# EAGLE design SmartSwitchBoard2x1 (EAGLE 6.2)
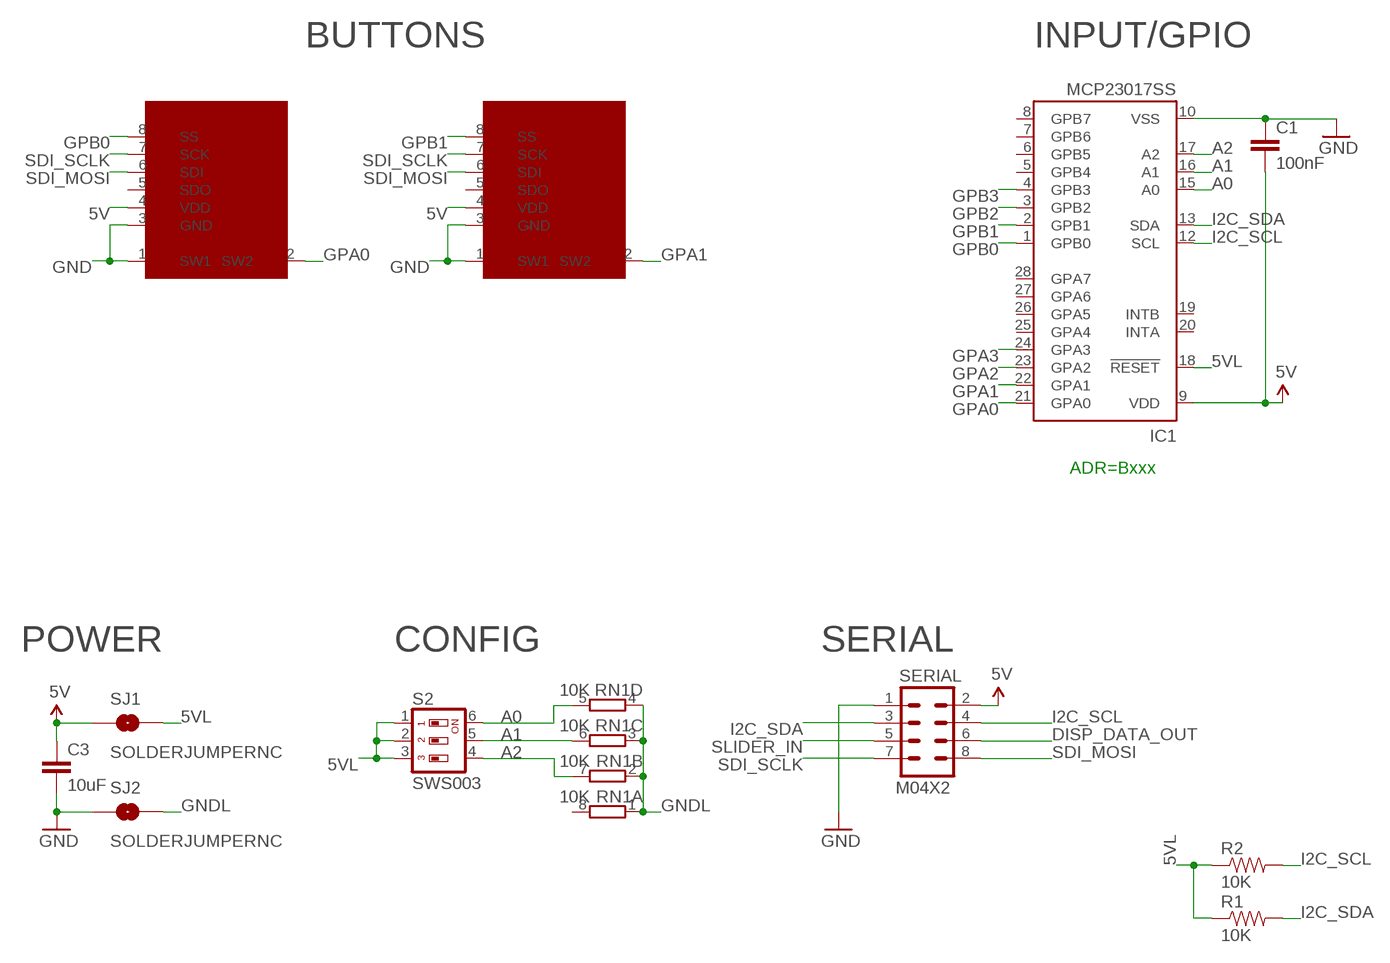
[diagram p0: schematic, sheet 1]

## Parts
C1  100nF  CAP0603-CAP  [0603-CAP]
C3  10uF  CAP0805  [0805]
IC1  MCP23017SS  [SSOP28]
R1  10K  RESISTOR0603-RES  [0603-RES]
R2  10K  RESISTOR0603-RES  [0603-RES]
RN1  10K  4R-NCAY16  [CAY16_HAND]
S2  SWS003  [SMS-003]
SERIAL  M04X2  [2X4]
SJ1  SOLDERJUMPERNC  [SJ_2S]
SJ2  SOLDERJUMPERNC  [SJ_2S]
U$2  SMART_SWITCHSMART_SWITCH_8PIN  [SMART_SWITCH]
U$3  SMART_SWITCHSMART_SWITCH_8PIN  [SMART_SWITCH]

## Nets
5V [Power]: C1.2 C3.1 IC1.9(VDD) SERIAL.2 SJ1.1 U$2.4(VDD) U$3.4(VDD)
5VL: IC1.18(!RESET) R1.1 R2.1 S2.1 S2.2 S2.3 SJ1.2
A0: IC1.15(A0) RN1.5 S2.6
A1: IC1.16(A1) RN1.6 S2.5
A2: IC1.17(A2) RN1.7 S2.4
DISP_DATA_OUT: SERIAL.6
GND [Power]: C1.1 C3.2 IC1.10(VSS) SERIAL.1 SJ2.1 U$2.1(SW1) U$2.3(GND) U$3.1(SW1) U$3.3(GND)
GNDL: RN1.1 RN1.2 RN1.3 RN1.4 SJ2.2
GPA0: IC1.21(GPA0) U$2.2(SW2)
GPA1: IC1.22(GPA1) U$3.2(SW2)
GPA2: IC1.23(GPA2)
GPA3: IC1.24(GPA3)
GPB0: IC1.1(GPB0) U$2.8(SS)
GPB1: IC1.2(GPB1) U$3.8(SS)
GPB2: IC1.3(GPB2)
GPB3: IC1.4(GPB3)
I2C_SCL: IC1.12(SCL) R2.2 SERIAL.4
I2C_SDA: IC1.13(SDA) R1.2 SERIAL.3
SDI_MOSI: SERIAL.8 U$2.6(SDI) U$3.6(SDI)
SDI_SCLK: SERIAL.7 U$2.7(SCK) U$3.7(SCK)
SLIDER_IN: SERIAL.5
Unconnected: IC1.5(GPB4) IC1.6(GPB5) IC1.7(GPB6) IC1.8(GPB7) IC1.19(INTB) IC1.20(INTA) IC1.25(GPA4) IC1.26(GPA5) IC1.27(GPA6) IC1.28(GPA7) RN1.8 U$2.5(SDO) U$3.5(SDO)

## Notes on the sheet
- BUTTONS | INPUT/GPIO
- ADR=Bxxx
- POWER | CONFIG | SERIAL

## Library data of the parts
C1 C3 = SparkFun:CAP: Capacitor Standard 0603 ceramic capacitor, and 0.1" leaded capacitor.
IC1 = microchip:MCP23017: http://ww1.microchip.com/downloads/en/DeviceDoc/21952a.pdf Source: http://ww1.microchip.com/downloads/en/DeviceDoc/21952a.pdf; MF: MICROCHIP; MPN: MCP23017-E/SS; OC_FARNELL: 1467674; OC_NEWARK: 31K2960
R1 R2 = SparkFun:RESISTOR: Resistor Basic schematic elements and footprints for 0603, 1206, and PTH resistors.
RN1 = SKAARHOJ:4R-N: Array Chip Resistor Source: RS Component / Phycomp; OC_FARNELL: unknown; OC_NEWARK: unknown
S2 = smd-special:SWS003: SMD Dip Switch 3 pol.
SERIAL = SparkFun:M04X2
SJ1 SJ2 = SparkFun:SOLDERJUMPER: Solder Jumper Standard SMD solder jumper. Used to automate production. Two varients : Normally Open and Normally Closed are the same, but have different paste layers. NC will have a large amount of paste and should jumper during reflow.
U$2 U$3 = SKAARHOJ:SMART_SWITCH: SMARTSWITCH IS15DSBFP4RGB www.nkksmartswitch.com

## Net classes
0 default: width 0.203 mm, drill 0.406 mm, clearance 0.203 mm
1 Power: width 0.406 mm, drill 0.61 mm, clearance 0.203 mm

## Board
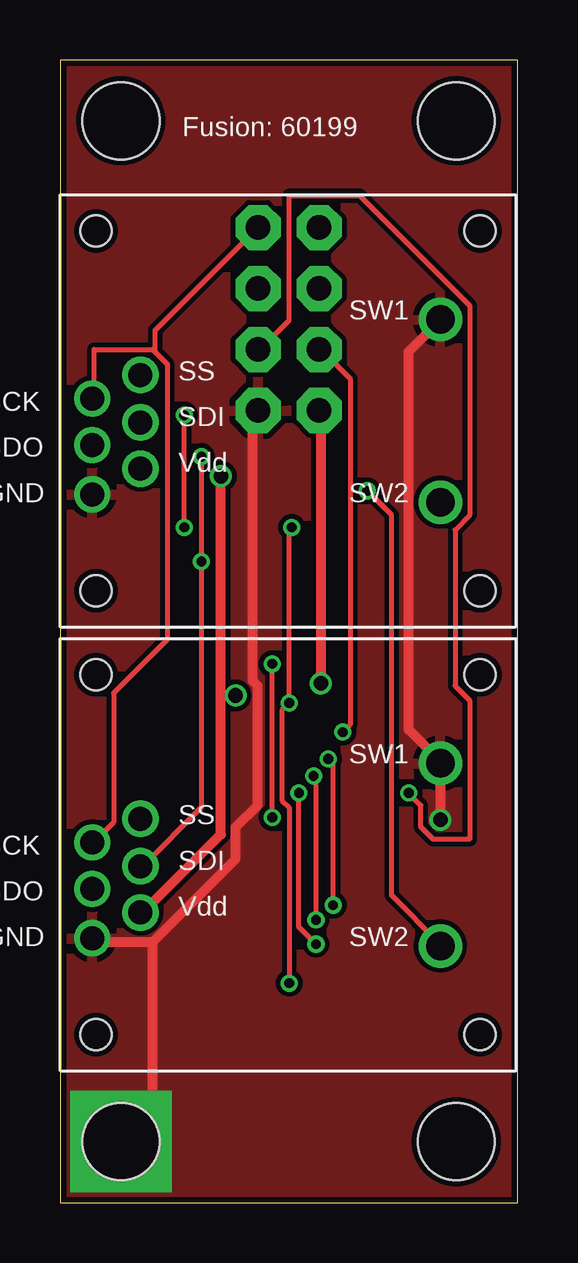
[diagram p1: board, top side]
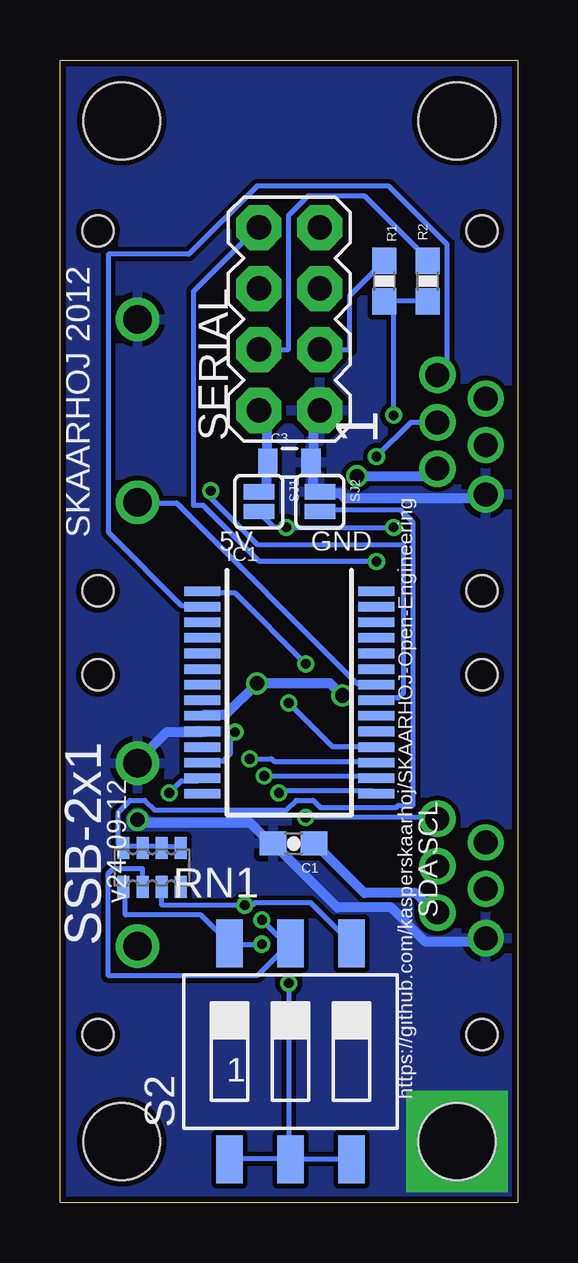
[diagram p2: board, bottom side, seen from below]

Size 19.08 x 47.62 mm. Coordinates in mm from the lower left corner, seen from the top.
Outline: 0,0 19.08,0 19.08,47.62 0,47.62 0,0
Copper layers (1*16): Top 0.035mm / dielectric 1.5mm / Bottom 0.035mm
Design rules: minimum track width 6mil, minimum drill 12mil, track to track 6mil, track to pad 6mil, pad to pad 6mil, via to via 6mil, smd to smd 0mil, copper to edge 10mil, drill to drill 10mil, minimum pad ring 10mil, minimum via ring 6mil, stop-mask expansion 2mil, vias tented up to drill 100mil, thermal gap 10mil
Holes 3.2 mm at 2.54,45.09 2.54,2.54 16.51,2.54 16.51,45.09

### Footprints (pad centres in the part's own frame; a part is rotated, then mirrored left to right if it is on the bottom)
0603-CAP = smd 1.1 x 1: 1 -0.85,0; 2 0.85,0
0805 = smd 0.8 x 1.2: 1 -0.9,0; 2 0.9,0
SSOP28 = smd 0.4 x 1.5: 1 -4.225,-3.625; 2 -3.575,-3.625; 3 -2.925,-3.625; 4 -2.275,-3.625; 5 -1.625,-3.625; 6 -0.975,-3.625; 7 -0.325,-3.625; 8 0.325,-3.625; 9 0.975,-3.625; 10 1.625,-3.625; 11 2.275,-3.625; 12 2.925,-3.625; 13 3.575,-3.625; 14 4.225,-3.625; 15 4.225,3.625; 16 3.575,3.625; 17 2.925,3.625; 18 2.275,3.625; 19 1.625,3.625; 20 0.975,3.625; 21 0.325,3.625; 22 -0.325,3.625; 23 -0.975,3.625; 24 -1.625,3.625; 25 -2.275,3.625; 26 -2.925,3.625; 27 -3.575,3.625; 28 -4.225,3.625
0603-RES = smd 1.1 x 1: 1 -0.85,0; 2 0.85,0
CAY16_HAND = smd 0.5 x 0.904: 1 -1.2,-0.813; 2 -0.4,-0.813; 3 0.4,-0.813; 4 1.2,-0.813; 5 1.2,0.813; 6 0.4,0.813; 7 -0.4,0.813; 8 -1.2,0.813
SMS-003 = smd 1.092 x 2.007: 1 -2.54,-4.496; 2 0,-4.496; 3 2.54,-4.496; 4 2.54,4.496; 5 0,4.496; 6 -2.54,4.496
2X4 = drill 1.016 pad 1.88 octagon: 1 -3.81,-1.27; 2 -3.81,1.27; 3 -1.27,-1.27; 4 -1.27,1.27; 5 1.27,-1.27; 6 1.27,1.27; 7 3.81,-1.27; 8 3.81,1.27
SJ_2S = smd 0.635 x 1.27: 1 -0.412,0; 2 0.412,0
SMART_SWITCH = drill 1.2: 1 6.35,3.81; 2 6.35,-3.81 | drill 1: 3 -8.153,-3.48; 4 -6.147,-2.413; 5 -8.153,-1.422; 6 -6.147,-0.483; 7 -8.153,0.508; 8 -6.147,1.499 | hole 1.3: -8.001,7.506; 8.001,7.506; 8.001,-7.506; -8.001,-7.506

### Placement (x,y rotation side)
C1  9.35,14.96 0 bottom
C3  9.53,30.84 0 bottom
IC1  9.53,21.26 270 bottom
R1  5.56,38.4 90 bottom
R2  3.76,38.4 90 bottom
RN1  15.24,13.97 180 bottom
S2  9.47,6.3 0 bottom
SERIAL  9.53,36.83 90 bottom
SJ1  10.79,29.21 270 bottom
SJ2  8.26,29.21 270 bottom
U$2  9.5,14.5 0 top
U$3  9.5,33 0 top

### Tracks (layer width: path | path; a pad name or v marks a point on that pad's centre or on a via)
5V  (via drill 0.61)
  Top 0.406: v10.87,21.64 10.87,33.02 SERIAL.2 | 6.71,21.13 6.71,15.34 3.45,12.09 U$2.4 | 6.71,21.13 v6.71,30.28 | 6.71,21.13 v7.32,21.13
  Bottom 0.406: SJ1.1 10.77,29.67 10.46,29.67 10.46,30.79 C3.1 10.46,30.99 10.46,33.02 SERIAL.2 | IC1.9 13.11,20.32 12.19,20.32 v10.87,21.64 7.82,21.64 v7.32,21.13 | C1.2 8.43,14.94 6.4,12.9 4.27,12.9 3.45,12.09 U$2.4 | v6.71,30.28 3.76,30.28 3.45,30.58 U$3.4
5VL  (via drill 0.41)
  Top 0.203: v9.65,28.14 9.55,28.04 v9.55,20.83 9.25,20.52 9.25,16.76 9.55,16.46 v9.55,9.14 | v5.18,28.14 v5.18,32.82
  Bottom 0.203: S2.3 7.01,1.83 9.45,1.83 S2.2 | S2.1 11.99,1.83 9.55,1.83 S2.2 | 5.18,37.59 5.49,37.59 R1.1 5.18,37.59 | 5.18,37.59 3.76,37.59 R2.1 | v9.55,20.83 7.72,19 5.99,19 IC1.18 | SJ1.2 10.77,28.75 10.16,28.14 v9.65,28.14 v5.18,28.14 | v5.18,32.82 5.18,37.59 | v9.55,9.14 9.55,1.93 S2.2
A0  (via drill 0.41)
  Top 0.203: v9.96,17.07 9.96,11.48 v10.67,10.77
  Bottom 0.203: RN1.5 16.36,13.11 16.36,11.99 13.21,11.99 S2.6 11.99,10.77 v10.67,10.77 | v9.96,17.07 9.86,17.17 6.1,17.17 5.99,17.07 IC1.15
A1  (via drill 0.41)
  Top 0.203: v10.57,17.78 10.67,17.68 v10.67,11.79
  Bottom 0.203: RN1.6 15.65,13.21 15.65,13.92 16.87,13.92 17.07,13.72 17.07,9.45 10.87,9.45 9.55,10.77 S2.5 9.65,10.77 v10.67,11.79 | v10.57,17.78 5.99,17.78 IC1.16
A2  (via drill 0.41)
  Top 0.203: v11.18,18.49 11.38,18.29 v11.38,12.39
  Bottom 0.203: S2.4 8.64,12.5 10.97,12.5 11.07,12.39 v11.38,12.39 14.83,12.39 14.83,13.11 RN1.7 | v11.18,18.49 10.26,18.49 10.16,18.39 5.99,18.39 IC1.17
GND  (via drill 0.61, 3.2)
  Top 0.406: U$3.1 15.85,36.78 14.53,35.46 14.53,19.71 15.85,18.39 U$2.1 15.85,18.19 v15.85,15.95 | 3.86,10.87 7.32,14.33 7.32,15.65 8.23,16.56 8.23,21.54 8.03,21.74 8.03,32.82 8.23,33.02 SERIAL.1 | 3.86,10.87 1.42,10.87 1.42,10.97 U$2.3 | v2.54,2.54 3.86,2.54 3.86,10.87
  Bottom 0.406: SERIAL.1 8.53,33.02 8.53,30.99 C3.2 8.53,30.79 8.53,29.67 8.33,29.67 SJ2.1 8.13,29.57 7.42,29.57 7.21,29.36 1.52,29.36 1.42,29.46 U$3.3 | U$2.3 1.42,10.97 1.52,10.87 3.86,10.87 5.28,12.29 7.52,12.29 10.16,14.94 C1.1 10.36,15.04 11.18,15.85 15.75,15.85 v15.85,15.95 | IC1.10 13.21,19.61 14.63,19.61 15.85,18.39 U$2.1
  pour Bottom: 0,0 0,47.62 19.05,47.62 19.05,0
  pour Top: 0,0 0,47.62 19.05,47.62 19.05,0
GNDL
  Bottom 0.203: RN1.1 14.12,14.83 14.83,14.83 RN1.2 14.94,14.83 15.54,14.83 RN1.3 15.65,14.83 16.36,14.83 RN1.4 16.36,14.94 16.66,14.94 16.66,16.26 16.15,16.76 15.54,16.76 15.14,16.36 9.65,16.36 9.25,16.76 8.53,16.76 8.23,16.46 5.08,16.46 4.98,16.56 4.37,16.56 4.37,28.35 4.88,28.85 8.23,28.85 SJ2.2
GPA0  (via drill 0.41)
  Top 0.203: v12.8,29.67 13.82,28.65 13.82,12.8 15.85,10.77 U$2.2
  Bottom 0.203: v12.8,29.67 12.8,29.36 10.87,27.43 4.78,27.43 4.78,21.23 4.98,21.03 5.89,21.03 IC1.21
GPA1
  Bottom 0.203: IC1.22 5.99,21.64 6.71,21.64 14.22,29.16 15.85,29.16 U$3.2
GPB0  (via drill 0.41)
  Top 0.203: v8.84,16.05 v8.84,22.45
  Bottom 0.203: v8.84,22.45 11.79,25.4 13.11,25.4 IC1.1 | v8.84,16.05 3.45,16.05 U$2.8
GPB1
  Bottom 0.203: IC1.2 13.21,24.89 14.02,24.89 17.07,27.94 17.07,39.52 13.72,39.52 10.87,42.37 5.38,42.37 2.95,39.93 2.95,34.54 3.35,34.54 U$3.8
I2C_SCL  (via drill 0.41)
  Top 0.203: v11.79,19.61 12.09,19.91 12.09,34.34 10.87,35.56 SERIAL.4
  Bottom 0.203: SERIAL.4 9.55,35.56 9.55,41.15 8.74,41.96 6.4,41.96 3.76,39.32 R2.2 | v11.79,19.61 11.99,19.61 11.99,18.69 12.29,18.39 13.11,18.39 IC1.12
I2C_SDA  (via drill 0.41)
  Top 0.203: v14.53,17.07 15.04,16.56 15.04,15.65 15.54,15.14 17.07,15.14 17.07,20.93 16.46,21.54 16.46,28.04 17.07,28.65 17.07,37.39 12.5,41.96 9.55,41.96 9.55,36.78 8.33,35.56 SERIAL.3
  Bottom 0.203: SERIAL.3 7.01,35.56 7.01,37.8 5.59,39.22 R1.2 | v14.53,17.07 14.02,17.58 13.31,17.58 13.21,17.68 IC1.13
SDI_MOSI  (via drill 0.41)
  Top 0.203: v5.89,31.09 v5.89,26.72 5.89,16.46 3.45,14.02 U$2.6
  Bottom 0.203: v5.89,31.09 4.47,32.51 3.45,32.51 U$3.6 | v5.89,26.72 10.77,26.72 13.11,29.06 13.51,29.06 13.51,38 10.87,40.64 SERIAL.8
SDI_SCLK
  Top 0.203: 3.91,35.51 3.86,35.56 1.42,35.56 1.42,33.53 U$3.7 | 3.91,35.51 4.47,34.95 4.47,23.47 2.23,21.23 2.23,15.85 1.42,15.04 U$2.7 | SERIAL.7 8.23,40.64 3.96,36.37 3.96,35.56 3.91,35.51

### Text on the board
_tsilk: Fusion: 60199
_bsilk: SKAARHOJ 2012 | 1 | GND | 5V | SSB-2x1 | v24-09-12 | SCL | SDA | https://github.com/kasperskaarhoj/SKAARHOJ-Open-Engineering